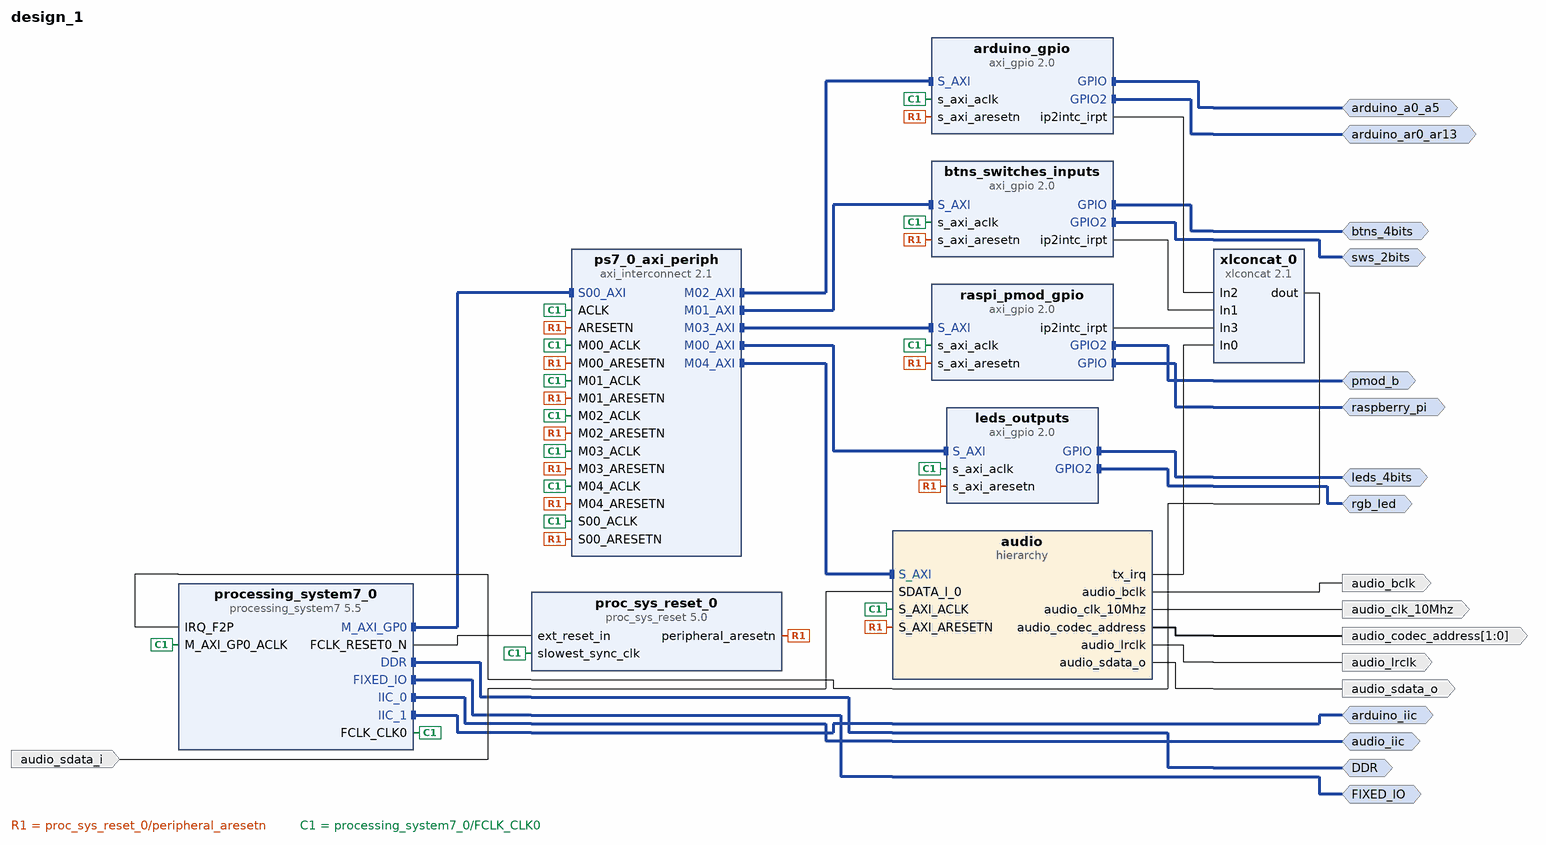
[diagram p0: block diagram of the top level]
# Vivado block design design_1, xc7z020clg400-1, Vivado 2023.1
create_bd_design design_1

create_bd_intf_port -mode Master -vlnv xilinx.com:interface:ddrx_rtl:1.0 DDR
create_bd_intf_port -mode Master -vlnv xilinx.com:display_processing_system7:fixedio_rtl:1.0 FIXED_IO
create_bd_intf_port -mode Master -vlnv xilinx.com:interface:gpio_rtl:1.0 leds_4bits
create_bd_intf_port -mode Master -vlnv xilinx.com:interface:gpio_rtl:1.0 rgb_led
create_bd_intf_port -mode Master -vlnv xilinx.com:interface:gpio_rtl:1.0 btns_4bits
create_bd_intf_port -mode Master -vlnv xilinx.com:interface:gpio_rtl:1.0 sws_2bits
create_bd_intf_port -mode Master -vlnv xilinx.com:interface:gpio_rtl:1.0 arduino_a0_a5
create_bd_intf_port -mode Master -vlnv xilinx.com:interface:gpio_rtl:1.0 raspberry_pi
create_bd_intf_port -mode Master -vlnv xilinx.com:interface:iic_rtl:1.0 audio_iic
create_bd_intf_port -mode Master -vlnv xilinx.com:interface:iic_rtl:1.0 arduino_iic
create_bd_intf_port -mode Master -vlnv xilinx.com:interface:gpio_rtl:1.0 pmod_b
create_bd_intf_port -mode Master -vlnv xilinx.com:interface:gpio_rtl:1.0 arduino_ar0_ar13
create_bd_port -dir O -type clk audio_clk_10Mhz
create_bd_port -dir O audio_bclk
create_bd_port -dir O audio_lrclk
create_bd_port -dir O audio_sdata_o
create_bd_port -dir O -from 1 -to 0 audio_codec_address
create_bd_port -dir I audio_sdata_i

create_bd_cell -type ip -vlnv xilinx.com:ip:processing_system7:5.5 processing_system7_0
set_property -dict [list \
  CONFIG.PCW_APU_PERIPHERAL_FREQMHZ 650 \
  CONFIG.PCW_CRYSTAL_PERIPHERAL_FREQMHZ 50 \
  CONFIG.PCW_ENET0_PERIPHERAL_ENABLE 0 \
  CONFIG.PCW_FPGA0_PERIPHERAL_FREQMHZ 100 \
  CONFIG.PCW_FPGA1_PERIPHERAL_FREQMHZ 50 \
  CONFIG.PCW_GPIO_MIO_GPIO_ENABLE 1 \
  CONFIG.PCW_GPIO_MIO_GPIO_IO MIO \
  CONFIG.PCW_I2C0_I2C0_IO EMIO \
  CONFIG.PCW_I2C0_PERIPHERAL_ENABLE 1 \
  CONFIG.PCW_I2C1_I2C1_IO EMIO \
  CONFIG.PCW_I2C1_PERIPHERAL_ENABLE 1 \
  CONFIG.PCW_I2C_PERIPHERAL_FREQMHZ 108.333336 \
  CONFIG.PCW_I2C_RESET_ENABLE 1 \
  CONFIG.PCW_I2C_RESET_SELECT {Share reset pin} \
  CONFIG.PCW_IRQ_F2P_INTR 1 \
  CONFIG.PCW_M_AXI_GP0_FREQMHZ 10 \
  CONFIG.PCW_PERIPHERAL_BOARD_PRESET part0 \
  CONFIG.PCW_PRESET_BANK1_VOLTAGE {LVCMOS 1.8V} \
  CONFIG.PCW_QSPI_GRP_FBCLK_ENABLE 1 \
  CONFIG.PCW_QSPI_GRP_FBCLK_IO {MIO 8} \
  CONFIG.PCW_QSPI_GRP_SINGLE_SS_ENABLE 1 \
  CONFIG.PCW_QSPI_GRP_SINGLE_SS_IO {MIO 1 .. 6} \
  CONFIG.PCW_QSPI_PERIPHERAL_ENABLE 1 \
  CONFIG.PCW_QSPI_QSPI_IO {MIO 1 .. 6} \
  CONFIG.PCW_SD0_PERIPHERAL_ENABLE 0 \
  CONFIG.PCW_SINGLE_QSPI_DATA_MODE x4 \
  CONFIG.PCW_UART0_PERIPHERAL_ENABLE 1 \
  CONFIG.PCW_UART0_UART0_IO {MIO 14 .. 15} \
  CONFIG.PCW_UART1_PERIPHERAL_ENABLE 0 \
  CONFIG.PCW_UART_PERIPHERAL_FREQMHZ 100 \
  CONFIG.PCW_UIPARAM_DDR_BUS_WIDTH {16 Bit} \
  CONFIG.PCW_UIPARAM_DDR_FREQ_MHZ 525 \
  CONFIG.PCW_UIPARAM_DDR_PARTNO {MT41J256M16 RE-125} \
  CONFIG.PCW_USB0_PERIPHERAL_ENABLE 0 \
  CONFIG.PCW_USB_RESET_ENABLE 1 \
  CONFIG.PCW_USE_FABRIC_INTERRUPT 1 \
] [get_bd_cells processing_system7_0]
# 491 more settings of processing_system7_0 are not shown: defaults, MIO pin electricals, DDR timing, and values the tool derives
create_bd_cell -type ip -vlnv xilinx.com:ip:proc_sys_reset:5.0 proc_sys_reset_0
create_bd_cell -type ip -vlnv xilinx.com:ip:axi_gpio:2.0 leds_outputs
set_property -dict [list \
  CONFIG.GPIO2_BOARD_INTERFACE rgb_led \
  CONFIG.GPIO_BOARD_INTERFACE leds_4bits \
  CONFIG.USE_BOARD_FLOW true \
] [get_bd_cells leds_outputs]
create_bd_cell -type ip -vlnv xilinx.com:ip:axi_interconnect:2.1 ps7_0_axi_periph
set_property -dict {CONFIG.NUM_MI 5} [get_bd_cells ps7_0_axi_periph]
create_bd_cell -type ip -vlnv xilinx.com:ip:axi_gpio:2.0 btns_switches_inputs
set_property -dict [list \
  CONFIG.C_INTERRUPT_PRESENT 1 \
  CONFIG.GPIO2_BOARD_INTERFACE sws_2bits \
  CONFIG.GPIO_BOARD_INTERFACE btns_4bits \
  CONFIG.USE_BOARD_FLOW true \
] [get_bd_cells btns_switches_inputs]
create_bd_cell -type ip -vlnv xilinx.com:ip:axi_gpio:2.0 arduino_gpio
set_property -dict [list \
  CONFIG.C_INTERRUPT_PRESENT 1 \
  CONFIG.GPIO2_BOARD_INTERFACE arduino_ar0_ar13 \
  CONFIG.GPIO_BOARD_INTERFACE arduino_a0_a5 \
  CONFIG.USE_BOARD_FLOW true \
] [get_bd_cells arduino_gpio]
create_bd_cell -type ip -vlnv xilinx.com:ip:axi_gpio:2.0 raspi_pmod_gpio
set_property -dict [list \
  CONFIG.C_GPIO2_WIDTH 8 \
  CONFIG.C_GPIO_WIDTH 27 \
  CONFIG.C_INTERRUPT_PRESENT 1 \
  CONFIG.C_IS_DUAL 1 \
  CONFIG.GPIO2_BOARD_INTERFACE Custom \
  CONFIG.GPIO_BOARD_INTERFACE Custom \
  CONFIG.USE_BOARD_FLOW true \
] [get_bd_cells raspi_pmod_gpio]
create_bd_cell -type ip -vlnv xilinx.com:ip:xlconcat:2.1 xlconcat_0
set_property -dict {CONFIG.NUM_PORTS 4} [get_bd_cells xlconcat_0]
create_bd_cell -type hier audio

# ---- hierarchy /audio ----
current_bd_instance /audio
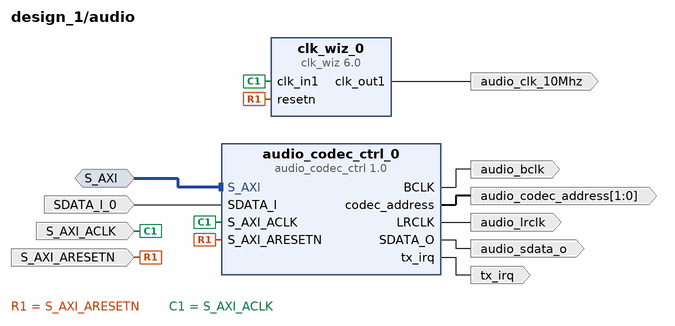
[diagram p1: block diagram inside /audio]
create_bd_intf_pin -mode Slave -vlnv xilinx.com:interface:aximm_rtl:1.0 S_AXI
create_bd_pin -dir I -type rst S_AXI_ARESETN
create_bd_pin -dir I -type clk S_AXI_ACLK
create_bd_pin -dir O -type clk audio_clk_10Mhz
create_bd_pin -dir O audio_bclk
create_bd_pin -dir O audio_lrclk
create_bd_pin -dir O audio_sdata_o
create_bd_pin -dir O tx_irq
create_bd_pin -dir O -from 1 -to 0 audio_codec_address
create_bd_pin -dir I SDATA_I_0

create_bd_cell -type ip -vlnv xilinx.com:ip:clk_wiz:6.0 clk_wiz_0
set_property -dict [list \
  CONFIG.CLKOUT1_JITTER 290.478 \
  CONFIG.CLKOUT1_PHASE_ERROR 133.882 \
  CONFIG.CLKOUT1_REQUESTED_OUT_FREQ 10.000 \
  CONFIG.MMCM_CLKFBOUT_MULT_F 15.625 \
  CONFIG.MMCM_CLKOUT0_DIVIDE_F 78.125 \
  CONFIG.MMCM_DIVCLK_DIVIDE 2 \
  CONFIG.RESET_PORT resetn \
  CONFIG.RESET_TYPE ACTIVE_LOW \
  CONFIG.USE_LOCKED false \
] [get_bd_cells clk_wiz_0]
create_bd_cell -type ip -vlnv xilinx.com:user:audio_codec_ctrl:1.0 audio_codec_ctrl_0

# ---- connections ----

current_bd_instance /audio
connect_bd_intf_net [get_bd_intf_pins S_AXI] [get_bd_intf_pins audio_codec_ctrl_0/S_AXI]
connect_bd_net -net SDATA_I_0_1 [get_bd_pins SDATA_I_0] [get_bd_pins audio_codec_ctrl_0/SDATA_I]
connect_bd_net [get_bd_pins audio_codec_ctrl_0/BCLK] [get_bd_pins audio_bclk]
connect_bd_net [get_bd_pins audio_codec_ctrl_0/LRCLK] [get_bd_pins audio_lrclk]
connect_bd_net [get_bd_pins audio_codec_ctrl_0/SDATA_O] [get_bd_pins audio_sdata_o]
connect_bd_net [get_bd_pins audio_codec_ctrl_0/codec_address] [get_bd_pins audio_codec_address]
connect_bd_net [get_bd_pins audio_codec_ctrl_0/tx_irq] [get_bd_pins tx_irq]
connect_bd_net [get_bd_pins clk_wiz_0/clk_out1] [get_bd_pins audio_clk_10Mhz]
connect_bd_net -net proc_sys_reset_0_peripheral_aresetn [get_bd_pins S_AXI_ARESETN] \
  [get_bd_pins audio_codec_ctrl_0/S_AXI_ARESETN] [get_bd_pins clk_wiz_0/resetn]
connect_bd_net -net processing_system7_0_FCLK_CLK0 [get_bd_pins S_AXI_ACLK] \
  [get_bd_pins audio_codec_ctrl_0/S_AXI_ACLK] [get_bd_pins clk_wiz_0/clk_in1]

current_bd_instance /
connect_bd_intf_net [get_bd_intf_ports arduino_a0_a5] [get_bd_intf_pins arduino_gpio/GPIO]
connect_bd_intf_net [get_bd_intf_ports arduino_ar0_ar13] [get_bd_intf_pins arduino_gpio/GPIO2]
connect_bd_intf_net -intf_net axi_gpio_0_GPIO [get_bd_intf_ports raspberry_pi] [get_bd_intf_pins raspi_pmod_gpio/GPIO]
connect_bd_intf_net -intf_net btns_switches_gpio_GPIO [get_bd_intf_ports btns_4bits] [get_bd_intf_pins btns_switches_inputs/GPIO]
connect_bd_intf_net -intf_net btns_switches_gpio_GPIO2 [get_bd_intf_ports sws_2bits] [get_bd_intf_pins btns_switches_inputs/GPIO2]
connect_bd_intf_net -intf_net leds_gpio_GPIO [get_bd_intf_ports leds_4bits] [get_bd_intf_pins leds_outputs/GPIO]
connect_bd_intf_net -intf_net leds_gpio_GPIO2 [get_bd_intf_ports rgb_led] [get_bd_intf_pins leds_outputs/GPIO2]
connect_bd_intf_net [get_bd_intf_ports DDR] [get_bd_intf_pins processing_system7_0/DDR]
connect_bd_intf_net [get_bd_intf_ports FIXED_IO] [get_bd_intf_pins processing_system7_0/FIXED_IO]
connect_bd_intf_net [get_bd_intf_ports audio_iic] [get_bd_intf_pins processing_system7_0/IIC_0]
connect_bd_intf_net [get_bd_intf_ports arduino_iic] [get_bd_intf_pins processing_system7_0/IIC_1]
connect_bd_intf_net [get_bd_intf_pins processing_system7_0/M_AXI_GP0] [get_bd_intf_pins ps7_0_axi_periph/S00_AXI]
connect_bd_intf_net [get_bd_intf_pins ps7_0_axi_periph/M00_AXI] [get_bd_intf_pins leds_outputs/S_AXI]
connect_bd_intf_net [get_bd_intf_pins ps7_0_axi_periph/M01_AXI] [get_bd_intf_pins btns_switches_inputs/S_AXI]
connect_bd_intf_net [get_bd_intf_pins ps7_0_axi_periph/M02_AXI] [get_bd_intf_pins arduino_gpio/S_AXI]
connect_bd_intf_net [get_bd_intf_pins ps7_0_axi_periph/M03_AXI] [get_bd_intf_pins raspi_pmod_gpio/S_AXI]
connect_bd_intf_net [get_bd_intf_pins ps7_0_axi_periph/M04_AXI] [get_bd_intf_pins audio/S_AXI]
connect_bd_intf_net [get_bd_intf_ports pmod_b] [get_bd_intf_pins raspi_pmod_gpio/GPIO2]
connect_bd_net -net SDATA_I_0_1 [get_bd_ports audio_sdata_i] [get_bd_pins audio/SDATA_I_0]
connect_bd_net [get_bd_pins arduino_gpio/ip2intc_irpt] [get_bd_pins xlconcat_0/In2]
connect_bd_net -net audio_codec_ctrl_0_BCLK [get_bd_pins audio/audio_bclk] [get_bd_ports audio_bclk]
connect_bd_net -net audio_codec_ctrl_0_LRCLK [get_bd_pins audio/audio_lrclk] [get_bd_ports audio_lrclk]
connect_bd_net -net audio_codec_ctrl_0_SDATA_O [get_bd_pins audio/audio_sdata_o] [get_bd_ports audio_sdata_o]
connect_bd_net -net audio_codec_ctrl_0_codec_address [get_bd_pins audio/audio_codec_address] [get_bd_ports audio_codec_address]
connect_bd_net -net audio_codec_ctrl_0_tx_irq [get_bd_pins audio/tx_irq] [get_bd_pins xlconcat_0/In0]
connect_bd_net [get_bd_pins btns_switches_inputs/ip2intc_irpt] [get_bd_pins xlconcat_0/In1]
connect_bd_net -net clk_wiz_0_clk_out1 [get_bd_pins audio/audio_clk_10Mhz] [get_bd_ports audio_clk_10Mhz]
connect_bd_net [get_bd_pins proc_sys_reset_0/peripheral_aresetn] \
  [get_bd_pins ps7_0_axi_periph/S00_ARESETN] [get_bd_pins leds_outputs/s_axi_aresetn] \
  [get_bd_pins ps7_0_axi_periph/M00_ARESETN] [get_bd_pins ps7_0_axi_periph/ARESETN] \
  [get_bd_pins btns_switches_inputs/s_axi_aresetn] [get_bd_pins ps7_0_axi_periph/M01_ARESETN] \
  [get_bd_pins arduino_gpio/s_axi_aresetn] [get_bd_pins ps7_0_axi_periph/M02_ARESETN] \
  [get_bd_pins raspi_pmod_gpio/s_axi_aresetn] [get_bd_pins ps7_0_axi_periph/M03_ARESETN] \
  [get_bd_pins ps7_0_axi_periph/M04_ARESETN] [get_bd_pins audio/S_AXI_ARESETN]
connect_bd_net [get_bd_pins processing_system7_0/FCLK_CLK0] \
  [get_bd_pins proc_sys_reset_0/slowest_sync_clk] [get_bd_pins processing_system7_0/M_AXI_GP0_ACLK] \
  [get_bd_pins ps7_0_axi_periph/S00_ACLK] [get_bd_pins leds_outputs/s_axi_aclk] [get_bd_pins ps7_0_axi_periph/M00_ACLK] \
  [get_bd_pins ps7_0_axi_periph/ACLK] [get_bd_pins btns_switches_inputs/s_axi_aclk] [get_bd_pins ps7_0_axi_periph/M01_ACLK] \
  [get_bd_pins arduino_gpio/s_axi_aclk] [get_bd_pins ps7_0_axi_periph/M02_ACLK] [get_bd_pins raspi_pmod_gpio/s_axi_aclk] \
  [get_bd_pins ps7_0_axi_periph/M03_ACLK] [get_bd_pins ps7_0_axi_periph/M04_ACLK] [get_bd_pins audio/S_AXI_ACLK]
connect_bd_net [get_bd_pins processing_system7_0/FCLK_RESET0_N] [get_bd_pins proc_sys_reset_0/ext_reset_in]
connect_bd_net [get_bd_pins raspi_pmod_gpio/ip2intc_irpt] [get_bd_pins xlconcat_0/In3]
connect_bd_net [get_bd_pins xlconcat_0/dout] [get_bd_pins processing_system7_0/IRQ_F2P]
set_property PFM.CLOCK {FCLK_CLK0 {id "0" is_default "true" proc_sys_reset "/proc_sys_reset_0" status "fixed" freq_hz "100000000"}} [get_bd_cells processing_system7_0]

# ---- address map ----
assign_bd_address -offset 0x41200000 -range 64K -target_address_space [get_bd_addr_spaces processing_system7_0/Data] [get_bd_addr_segs leds_outputs/S_AXI/Reg]
assign_bd_address -offset 0x41210000 -range 64K -target_address_space [get_bd_addr_spaces processing_system7_0/Data] [get_bd_addr_segs btns_switches_inputs/S_AXI/Reg]
assign_bd_address -offset 0x41220000 -range 64K -target_address_space [get_bd_addr_spaces processing_system7_0/Data] [get_bd_addr_segs arduino_gpio/S_AXI/Reg]
assign_bd_address -offset 0x41230000 -range 64K -target_address_space [get_bd_addr_spaces processing_system7_0/Data] [get_bd_addr_segs raspi_pmod_gpio/S_AXI/Reg]
assign_bd_address -offset 0x43C00000 -range 64K -target_address_space [get_bd_addr_spaces processing_system7_0/Data] [get_bd_addr_segs audio/audio_codec_ctrl_0/S_AXI/reg0]

validate_bd_design
save_bd_design
